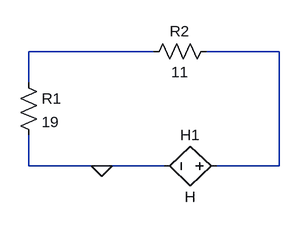
[diagram p0: schematic Draft1.asc]
Draft1.asc, the LTspice schematic file:
Version 4
SHEET 1 880 680
WIRE 208 80 16 80
WIRE 400 80 288 80
WIRE 16 128 16 80
WIRE 16 256 16 208
WIRE 128 256 16 256
WIRE 224 256 128 256
WIRE 400 256 400 80
WIRE 400 256 304 256
FLAG 128 256 0
SYMBOL res 0 112 R0
SYMATTR InstName R1
SYMATTR Value 19
SYMBOL res 304 64 R90
WINDOW 0 0 56 VBottom 2
WINDOW 3 32 56 VTop 2
SYMATTR InstName R2
SYMATTR Value 11
SYMBOL h 320 256 R90
WINDOW 0 -32 56 VBottom 2
WINDOW 3 32 56 VTop 2
SYMATTR InstName H1

The netlist it stands for:
* Draft1.asc
R1 N001 0 19
R2 N002 N001 11
H1 N002 0 H
.backanno
.end